# EAGLE design untitled2 (EAGLE 9.6.1)
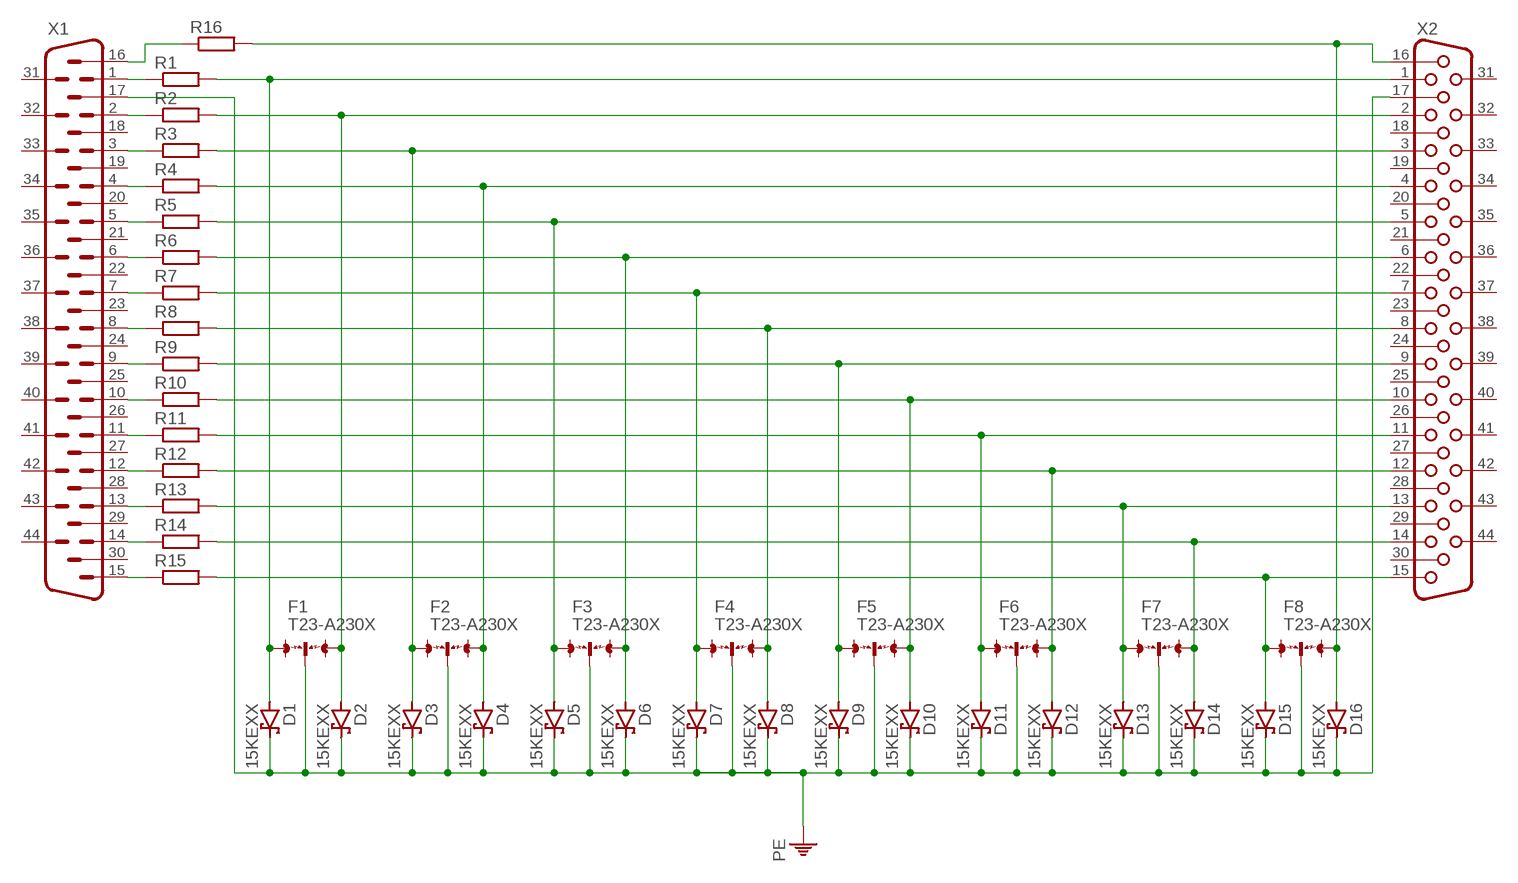
[diagram p0: schematic, sheet 1]

## Parts
D1  15KEXX  [CB429-17]
D2  15KEXX  [CB429-17]
D3  15KEXX  [CB429-17]
D4  15KEXX  [CB429-17]
D5  15KEXX  [CB429-17]
D6  15KEXX  [CB429-17]
D7  15KEXX  [CB429-17]
D8  15KEXX  [CB429-17]
D9  15KEXX  [CB429-17]
D10  15KEXX  [CB429-17]
D11  15KEXX  [CB429-17]
D12  15KEXX  [CB429-17]
D13  15KEXX  [CB429-17]
D14  15KEXX  [CB429-17]
D15  15KEXX  [CB429-17]
D16  15KEXX  [CB429-17]
F1  T23-A230X  [T23-A230X]
F2  T23-A230X  [T23-A230X]
F3  T23-A230X  [T23-A230X]
F4  T23-A230X  [T23-A230X]
F5  T23-A230X  [T23-A230X]
F6  T23-A230X  [T23-A230X]
F7  T23-A230X  [T23-A230X]
F8  T23-A230X  [T23-A230X]
R1  R-EU_R1210  [R1210]
R2  R-EU_R1210  [R1210]
R3  R-EU_R1210  [R1210]
R4  R-EU_R1210  [R1210]
R5  R-EU_R1210  [R1210]
R6  R-EU_R1210  [R1210]
R7  R-EU_R1210  [R1210]
R8  R-EU_R1210  [R1210]
R9  R-EU_R1210  [R1210]
R10  R-EU_R1210  [R1210]
R11  R-EU_R1210  [R1210]
R12  R-EU_R1210  [R1210]
R13  R-EU_R1210  [R1210]
R14  R-EU_R1210  [R1210]
R15  R-EU_R1210  [R1210]
R16  R-EU_R1210  [R1210]
X1  HM44H  [HDM44H]
X2  HF44H  [HDF44H]

## Nets
N$1: D1.A F1.1 R1.2 X2.1
N$2: D2.A F1.3 R2.2 X2.2
N$3: D3.A F2.1 R3.2 X2.3
N$4: D4.A F2.3 R4.2 X2.4
N$5: D5.A F3.1 R5.2 X2.5
N$6: D6.A F3.3 R6.2 X2.6
N$7: D7.A F4.1 R7.2 X2.7
N$8: D8.A F4.3 R8.2 X2.8
N$9: D9.A F5.1 R9.2 X2.9
N$10: D10.A F5.3 R10.2 X2.10
N$11: D11.A F6.1 R11.2 X2.11
N$12: D12.A F6.3 R12.2 X2.12
N$13: D13.A F7.1 R13.2 X2.13
N$14: D14.A F7.3 R14.2 X2.14
N$15: D15.A F8.1 R15.2 X2.15
N$16: D16.A F8.3 R16.2 X2.16
N$17: R1.1 X1.1
N$18: R2.1 X1.2
N$19: R3.1 X1.3
N$20: R4.1 X1.4
N$21: R5.1 X1.5
N$22: R6.1 X1.6
N$23: R7.1 X1.7
N$24: R8.1 X1.8
N$25: R9.1 X1.9
N$26: R10.1 X1.10
N$27: R11.1 X1.11
N$28: R12.1 X1.12
N$29: R13.1 X1.13
N$30: R14.1 X1.14
N$31: R16.1 X1.16
N$32: R15.1 X1.15
PE: D1.C D2.C D3.C D4.C D5.C D6.C D7.C D8.C D9.C D10.C D11.C D12.C D13.C D14.C D15.C D16.C F1.2 F2.2 F3.2 F4.2 F5.2 F6.2 F7.2 F8.2 X1.17 X2.17
Unconnected: X1.18 X1.19 X1.20 X1.21 X1.22 X1.23 X1.24 X1.25 X1.26 X1.27 X1.28 X1.29 X1.30 X1.31 X1.32 X1.33 X1.34 X1.35 X1.36 X1.37 X1.38 X1.39 X1.40 X1.41 X1.42 X1.43 X1.44 X2.18 X2.19 X2.20 X2.21 X2.22 X2.23 X2.24 X2.25 X2.26 X2.27 X2.28 X2.29 X2.30 X2.31 X2.32 X2.33 X2.34 X2.35 X2.36 X2.37 X2.38 X2.39 X2.40 X2.41 X2.42 X2.43 X2.44

## Library data of the parts
D1-D16 = diode:15KEXX: DIODE
F1-F8 = discrete:T23-A230X: 3-electrode arrester B88069X8740B502 Source: EPCOS .. t23a230xx8740.pdf
R1-R16 = rcl:R-EU_: RESISTOR, European symbol; SPICEPREFIX: R
X1 = con-subd:HM44: SUB-D; OC_FARNELL: unknown; OC_NEWARK: unknown
X2 = con-subd:HF44: SUB-D; OC_FARNELL: unknown; OC_NEWARK: unknown

## Board
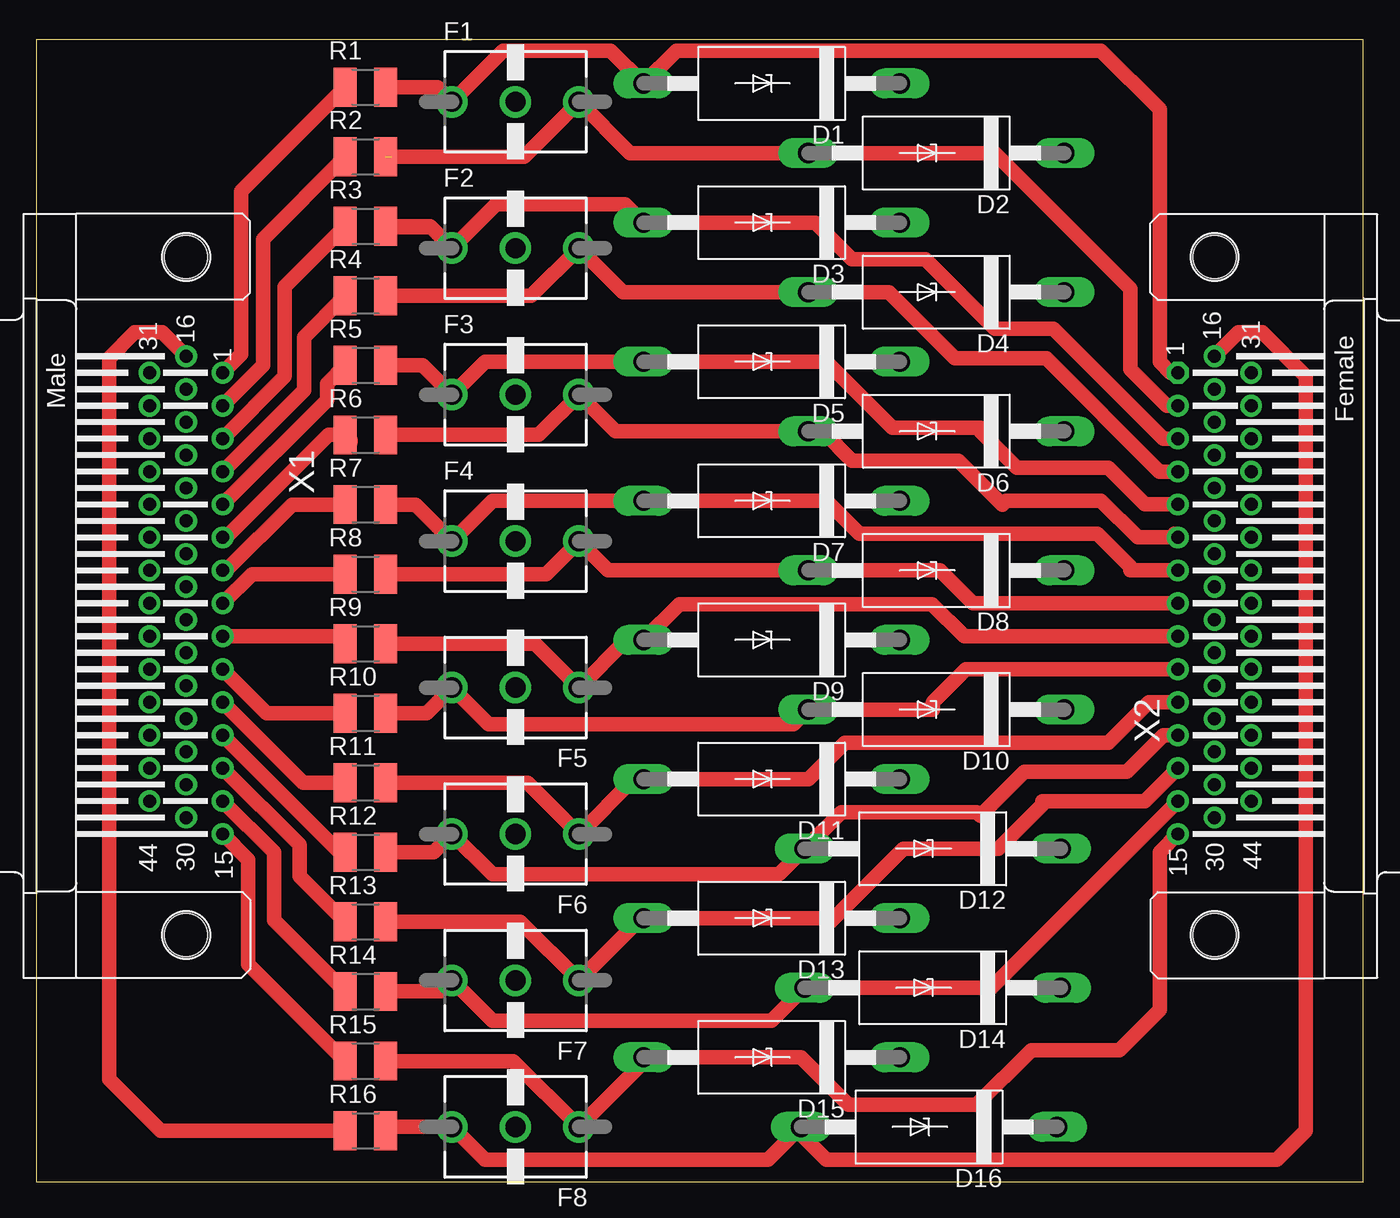
[diagram p1: board, top side]
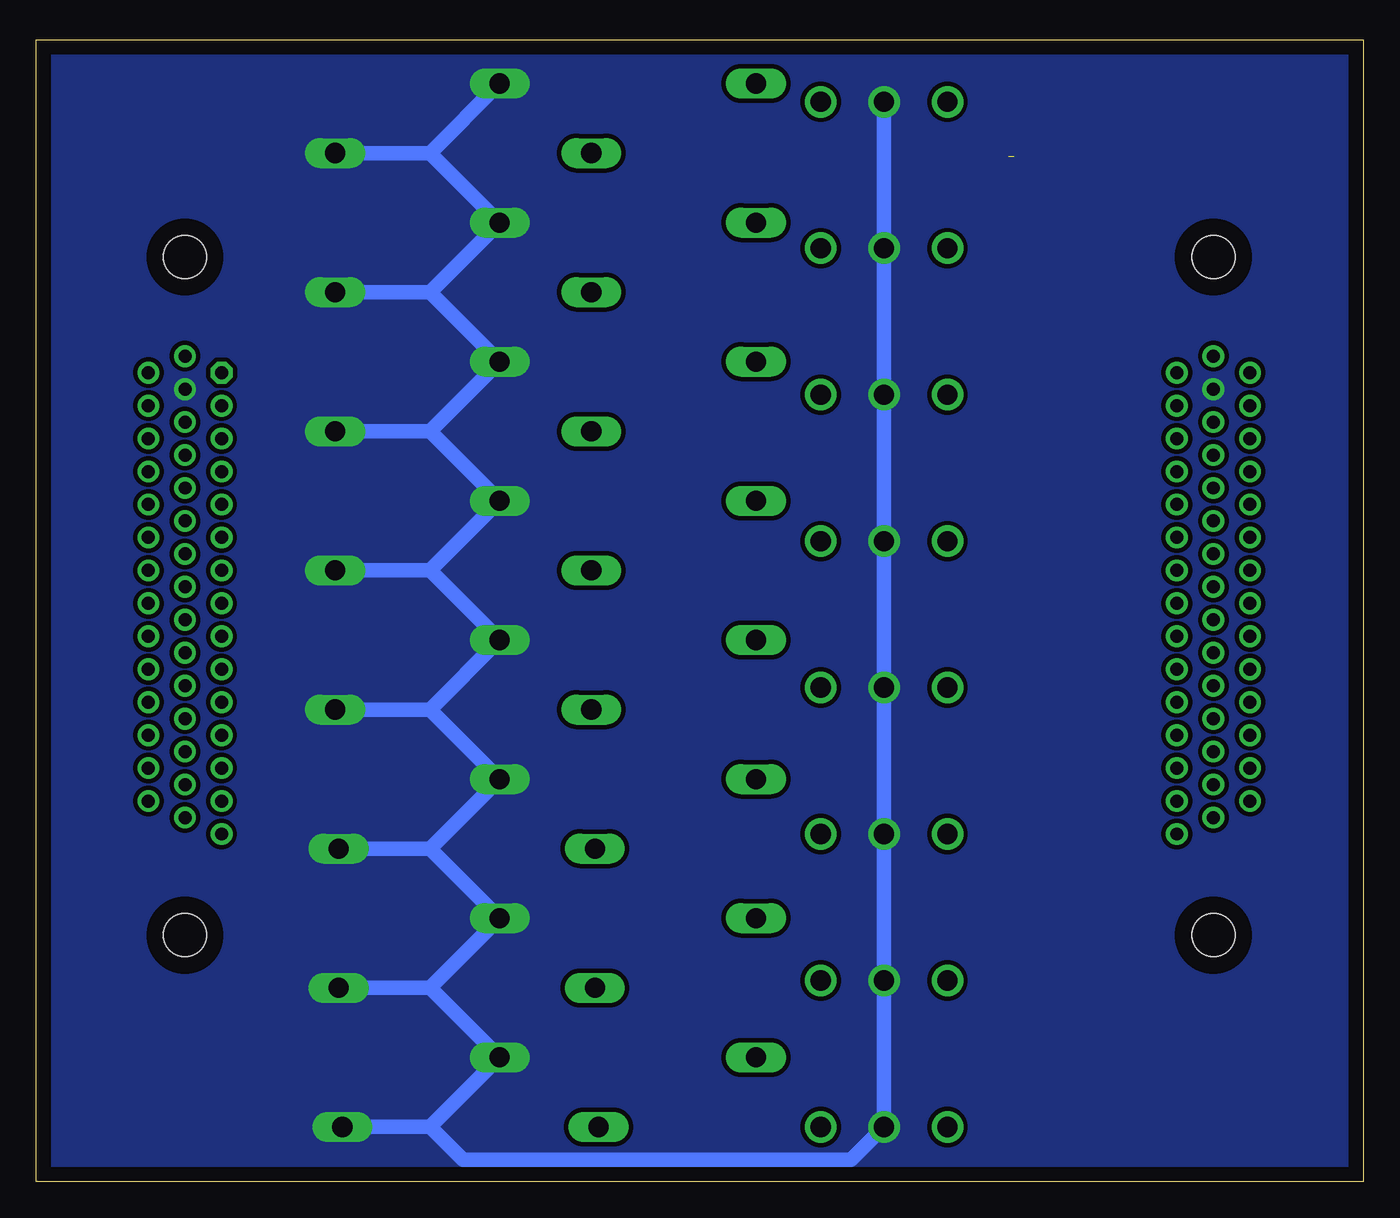
[diagram p2: board, bottom side, seen from below]

Size 92.13 x 79.24 mm. Coordinates in mm from the lower left corner, seen from the top.
Outline: 0,0 92.13,0 92.13,79.24 0,79.24 0,0
Copper layers (1*16): Top 0.035mm / dielectric 1.5mm / Bottom 0.035mm
Design rules "default": minimum track width 15mil, minimum drill 32mil, track to track 12mil, track to pad 12mil, pad to pad 12mil, via to via 12mil, smd to smd 6mil, copper to edge 40mil, drill to drill 40mil, minimum pad ring 12mil, minimum via ring 12mil, stop-mask expansion 4mil, vias tented up to drill 0mil, thermal gap 10mil

### Footprints (pad centres in the part's own frame; a part is rotated, then mirrored left to right if it is on the bottom)
CB429-17 = drill 1.397 long: A 8.89,0; C -8.89,0
T23-A230X = drill 1.4 pad 2.184: 1 -4.4,0; 2 0,0; 3 4.4,0
R1210 = smd 1.6 x 2.7: 1 -1.4,0; 2 1.4,0
HDM44H = drill 0.9: 1 -15.497,2.54; 2 -13.211,2.54; 3 -10.925,2.54; 4 -8.639,2.54; 5 -6.353,2.54; 6 -4.067,2.54; 7 -1.781,2.54; 8 0.505,2.54; 9 2.791,2.54; 10 5.077,2.54; 11 7.363,2.54; 12 9.649,2.54; 13 11.935,2.54; 14 14.221,2.54; 15 16.507,2.54; 16 -16.64,0; 17 -14.354,0; 18 -12.068,0; 19 -9.782,0; 20 -7.496,0; 21 -5.21,0; 22 -2.924,0; 23 -0.638,0; 24 1.648,0; 25 3.934,0; 26 6.22,0; 27 8.506,0; 28 10.792,0; 29 13.078,0; 30 15.364,0; 31 -15.497,-2.54; 32 -13.211,-2.54; 33 -10.925,-2.54; 34 -8.639,-2.54; 35 -6.353,-2.54; 36 -4.067,-2.54; 37 -1.781,-2.54; 38 0.505,-2.54; 39 2.791,-2.54; 40 5.077,-2.54; 41 7.363,-2.54; 42 9.649,-2.54; 43 11.935,-2.54; 44 14.221,-2.54 | hole 3: -23.52,0; 23.52,0
HDF44H = drill 0.9 octagon: 1 15.497,2.54 | drill 0.9: 2 13.211,2.54; 3 10.925,2.54; 4 8.639,2.54; 5 6.353,2.54; 6 4.067,2.54; 7 1.781,2.54; 8 -0.505,2.54; 9 -2.791,2.54; 10 -5.077,2.54; 11 -7.363,2.54; 12 -9.649,2.54; 13 -11.935,2.54; 14 -14.221,2.54; 15 -16.507,2.54; 16 16.64,0; 17 14.354,0; 18 12.068,0; 19 9.782,0; 20 7.496,0; 21 5.21,0; 22 2.924,0; 23 0.638,0; 24 -1.648,0; 25 -3.934,0; 26 -6.22,0; 27 -8.506,0; 28 -10.792,0; 29 -13.078,0; 30 -15.364,0; 31 15.497,-2.54; 32 13.211,-2.54; 33 10.925,-2.54; 34 8.639,-2.54; 35 6.353,-2.54; 36 4.067,-2.54; 37 1.781,-2.54; 38 -0.505,-2.54; 39 -2.791,-2.54; 40 -5.077,-2.54; 41 -7.363,-2.54; 42 -9.649,-2.54; 43 -11.935,-2.54; 44 -14.221,-2.54 | hole 3: -23.52,0; 23.52,0

### Placement (x,y rotation side)
D1  51.05,76.2 180 top
D2  62.48,71.37 180 top
D3  51.05,66.55 180 top
D4  62.48,61.72 180 top
D5  51.05,56.9 180 top
D6  62.48,52.07 180 top
D7  51.05,47.24 180 top
D8  62.48,42.42 180 top
D9  51.05,37.59 180 top
D10  62.48,32.77 180 top
D11  51.05,27.94 180 top
D12  62.23,23.11 180 top
D13  51.05,18.29 180 top
D14  62.23,13.46 180 top
D15  51.05,8.64 180 top
D16  61.98,3.81 180 top
F1  33.27,74.93 0 top
F2  33.27,64.77 0 top
F3  33.27,54.61 0 top
F4  33.27,44.45 0 top
F5  33.27,34.29 180 top
F6  33.27,24.13 180 top
F7  33.27,13.97 180 top
F8  33.27,3.81 180 top
R1  22.86,75.95 0 top
R2  22.86,71.12 0 top
R3  22.86,66.29 0 top
R4  22.86,61.47 0 top
R5  22.86,56.64 0 top
R6  22.86,51.82 0 top
R7  22.86,46.99 0 top
R8  22.86,42.16 0 top
R9  22.86,37.34 0 top
R10  22.86,32.51 0 top
R11  22.86,27.69 0 top
R12  22.86,22.86 0 top
R13  22.86,18.03 0 top
R14  22.86,13.21 0 top
R15  22.86,8.38 0 top
R16  22.86,3.56 0 top
X1  10.41,40.64 270 top
X2  81.79,40.64 90 top

### Tracks (layer width: path | path; a pad name or v marks a point on that pad's centre or on a via)
N$1
  Top 1.016: X2.1 78.74,56.14 77.98,56.9 77.98,74.41 73.91,78.48 44.44,78.48 D1.A 39.89,78.48 32.42,78.48 F1.1 27.86,75.95 R1.2
N$2  (1 unrouted)
  Top 1.016: 24.64,71.12 33.86,71.12 F1.3 41.23,71.37 D2.A 66.55,71.37 75.95,61.98 75.95,56.39 78.48,53.85 X2.2
N$3
  Top 1.016: 24.3,66.22 27.43,66.22 F2.1 | F2.1 31.92,67.82 40.89,67.82 D3.A 54.1,66.55 56.64,64.01 61.72,64.01 66.55,59.18 70.61,59.18 78.23,51.56 X2.3 | R3.2 27.35,66.29 F2.1
N$4
  Top 1.016: X2.4 77.97,49.28 70.1,57.15 63.75,57.15 59.18,61.72 D4.A 40.72,61.72 F2.3 34.37,61.47 R4.2
N$5
  Top 1.016: X2.5 76.96,46.99 74.42,49.53 68.07,49.53 65.53,52.07 65.53,52.32 59.44,52.32 54.86,56.9 D5.A 31.16,56.9 F3.1 26.84,56.64 24.38,56.64 R5.2
N$6
  Top 1.016: 79,44.96 X2.6 77.22,44.71 77.22,44.7 76.45,44.7 73.91,47.24 67.31,47.24 67.06,46.99 64.01,50.04 56.64,50.04 54.61,52.07 D6.A 40.21,52.07 F3.3 34.88,51.82 R6.2
N$7
  Top 1.016: X2.7 75.95,42.42 75.95,42.67 73.66,44.96 57.15,44.96 54.86,47.24 D7.A 31.67,47.24 F4.1 26.33,46.99 R7.2
N$8
  Top 1.016: X2.8 65.03,40.13 65.02,40.13 62.74,42.42 D8.A 39.71,42.42 F4.3 35.39,42.16 R8.2
N$9
  Top 1.016: X2.9 64.42,37.85 62.19,40.09 44.66,40.09 D9.A 40.98,37.59 F5.1 34.63,37.34 R9.2
N$10
  Top 1.016: X2.10 64.52,35.56 62.23,33.27 62.23,32.77 D10.A 52.58,31.75 31.41,31.75 F5.3 27.1,32.51 R10.2
N$11
  Top 1.016: X2.11 77.22,33.28 74.42,30.48 56.13,30.48 53.59,27.94 D11.A 41.48,27.94 F6.1 34.12,27.69 R11.2
N$12
  Top 1.016: X2.12 78.23,30.99 75.69,28.45 68.58,28.45 65.53,25.4 65.28,25.65 55.88,25.65 D12.A 51.56,21.34 31.67,21.34 F6.3 27.6,22.86 R12.2
N$13
  Top 1.016: X2.13 76.96,26.42 69.85,26.42 69.85,26.16 66.8,23.11 60.2,23.11 55.12,18.03 54.86,18.29 D13.A 41.99,18.29 F7.1 33.61,18.03 26.42,18.03 24.39,18.03 R13.2
N$14
  Top 1.016: 28.87,14.31 F7.3 | F7.3 31.67,11.18 51.05,11.18 D14.A 66.29,13.46 X2.14 | R14.2 28.11,13.21 F7.3
N$15
  Top 1.016: X2.15 77.98,22.86 77.98,11.94 75.18,9.14 69.09,9.14 65.28,5.33 56.39,5.33 53.09,8.64 D15.A 42.16,8.3 F8.1 33.1,8.38 25.65,8.38 R15.2 24.13,8.38
N$16
  Top 1.016: F8.3 31.16,1.52 50.8,1.52 D16.A 53.09,3.3 54.86,1.52 86.11,1.52 88.14,3.56 88.14,55.88 85.09,58.93 83.44,58.93 X2.16 | 28.62,3.56 F8.3 | F8.3 24.51,3.81 R16.2
N$17
  Top 1.016: X1.1 14.22,57.41 14.22,68.71 R1.1
N$18
  Top 1.016: X1.2 15.75,56.65 15.75,65.41 R2.1
N$19
  Top 1.016: X1.3 17.27,55.88 17.27,62.11 R3.1
N$20
  Top 1.016: X1.4 18.59,54.92 18.59,58.6 R4.1
N$21
  Top 1.016: X1.5 20.19,54.23 20.19,55.37 R5.1
N$22
  Top 1.016: X1.6 13.21,44.71 20.32,51.82 21.34,51.82 21.84,51.31 21.84,51.43 R6.1
N$23
  Top 1.016: X1.7 13.21,42.42 17.78,46.99 21.08,46.99 21.59,46.48 21.59,46.86 R7.1
N$24
  Top 1.016: X1.8 14.98,42.16 R8.1
N$25
  Top 1.016: X1.9 21.59,37.85 21.59,37.47 R9.1
N$26
  Top 1.016: X1.10 16.01,32.51 R10.1
N$27
  Top 1.016: X1.11 18.55,27.69 R11.1
N$28
  Top 1.016: X1.12 21.09,22.86 R12.1
N$29
  Top 1.016: X1.13 18.29,23.37 18.29,21.21 R13.1
N$30
  Top 1.016: X1.14 16.51,22.86 16.51,18.16 R14.1
N$31
  Top 1.016: X1.16 8.77,58.93 6.86,58.93 5.08,57.15 5.08,7.11 8.64,3.56 R16.1
N$32
  Top 1.016: X1.15 14.73,22.36 14.73,15.11 R15.1
PE
  Bottom 1.016: F1.2 F2.2 F3.2 F4.2 F5.2 F6.2 F7.2 F8.2 35.56,1.52 62.48,1.52 64.77,3.81 | D1.C 64.77,71.37 | 64.77,71.37 D2.C | 64.77,71.37 D3.C 64.77,61.72 | 64.77,61.72 D4.C | 64.77,61.72 D5.C 64.77,52.07 | 64.77,52.07 D6.C | 64.77,52.07 D7.C 64.77,42.42 | 64.77,42.42 D8.C | 64.77,42.42 D9.C 64.77,32.77 | 64.77,32.77 D10.C | 64.77,32.77 D11.C 64.77,23.11 | 64.77,23.11 D12.C | 64.77,23.11 D13.C 64.77,13.46 | 64.77,13.46 D14.C | 64.77,13.46 D15.C 64.77,3.81 | 64.77,3.81 D16.C
  pour Bottom (no thermals): -0.51,79.5 -0.51,0.25 91.95,0.25 92.2,0 92.46,0.25 92.96,0.25 92.96,79.76 -0.25,79.76